# EAGLE schematic led driver (EAGLE 6.4)
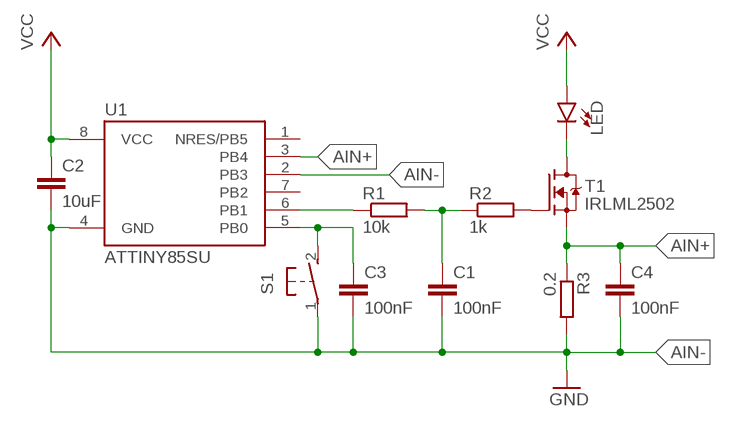
[diagram p0: schematic, sheet 1]

## Parts
C1  100nF  C-EUC0805  [C0805]
C2  10uF  C-EUC0805  [C0805]
C3  100nF  C-EUC0805  [C0805]
C4  100nF  C-EUC0805  [C0805]
LED  LED5MM  [LED_5MM]
R1  10k  R-EU_R0805  [R0805]
R2  1k  R-EU_R0805  [R0805]
R3  0.2  R-EU_R0805  [R0805]
S1  31-XX  [B3F-31XX]
T1  IRLML2502  MOSFET-N-SOT23  [SOT23]
U1  ATTINY85SU  [ATTINY85]

## Nets
AIN+: C4.1 R3.1 T1.2(S) U1.3(PB4)
AIN-: C1.2 C2.2 C3.2 C4.2 R3.2 S1.1(P) U1.2(PB3) U1.4(GND) ; supply symbol labelled GND
LED+: LED.A ; supply symbol labelled VCC
LED-: LED.K(C) T1.3(D)
N$3: C1.1 R1.2 R2.1
N$4: R1.1 U1.6(PB1)
N$5: C3.1 S1.2(S) U1.5(PB0)
N$7: R2.2 T1.1(G)
VCC: C2.1 U1.8(VCC)
Unconnected: U1.1(NRES/PB5) U1.7(PB2)

## Library data of the parts
C1-C4 = rcl:C-EU: CAPACITOR, European symbol
LED = SparkFun-LED:LED: LED (Generic) Standard schematic elements and footprints for 5mm, 3mm, 1206, and 0603 sized LEDs. Generic LEDs with no color specified.
R1-R3 = rcl:R-EU_: RESISTOR, European symbol
S1 = switch-omron:31-XX: OMRON SWITCH; MPN: B3F-3100; OC_FARNELL: 959704; OC_NEWARK: 36M3582
T1 = we-transistor:MOSFET-N: N-Channel MOSFET TSM3404, IRLML2502 (Vgs>=+/-20V, Vds>=20V, Id>=3A + Rds<=0.05Ohm @ Vgs=4.5V) BSS138 (Vgs>=+/-20V, Vds>=40V, Id>=0.2A + Rds<=3Ohm @ Vgs=4.5V)
U1 = attiny85:ATTINY85: ATMEL ATtiny 85